# Altium schematic sheet Peripherals.SchDoc
size A3; SheetNumber: 3; SheetTotal: 4; SPICEModelCacheDRPIFCMM: <root> / <DocumentId>DRPIFCMM</DocumentId> / </root>
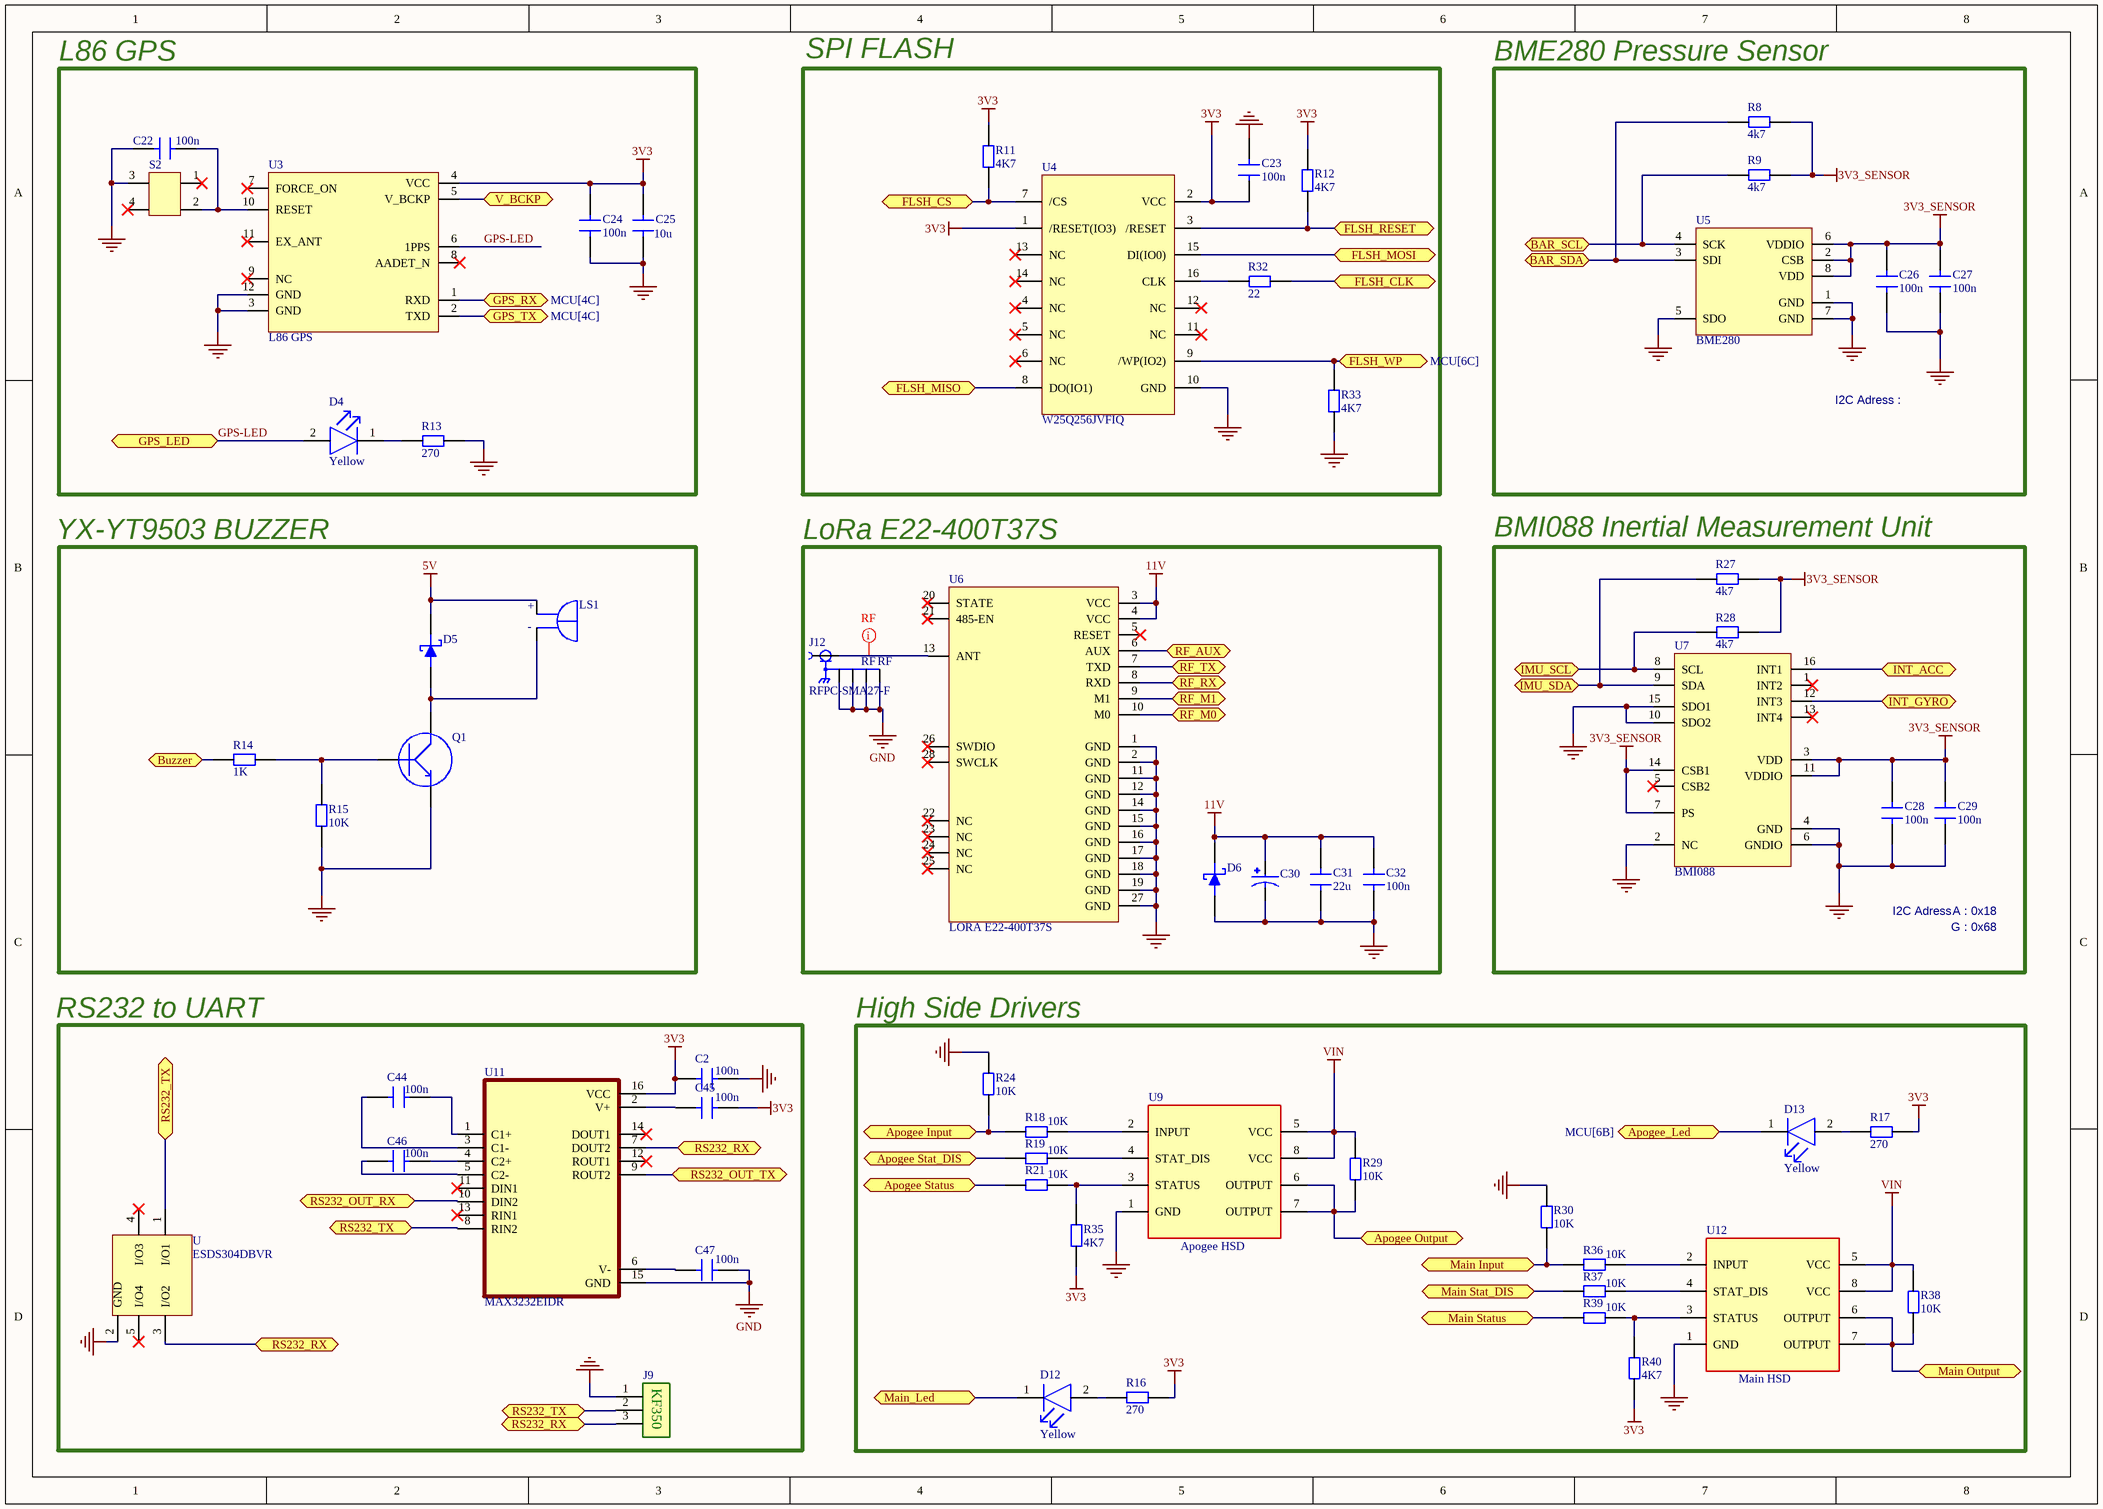
[diagram p0: Peripherals.SchDoc]

## Parts
C2  100n  [CAP 0603]
C22  100n  [CAP 0603]
C23  100n  [CAP 0603]
C24  100n  [CAP 0805]
C25  10u  [CAP 0805]
C26  100n  [CAP 0603]
C27  100n  [CAP 0603]
C28  100n  [CAP 0603]
C29  100n  [CAP 0603]
C30  EEEFK1E101XP  [CAP_EEEFK1E101XP]  (value not drawn)
C31  22u  [CAP 1210]
C32  100n  [CAP 0805]
C44  100n  [CAP 0603]
C45  100n  [CAP 0603]
C46  100n  [CAP 0603]
C47  100n  [CAP 0603]
D4  Yellow  [FP-LTST-C170YKT-MFG]
D5  TMBAT49FILM  [TMBAT49FILM]  (value not drawn)
D6  SMBJ14CA  [SMBJ12CA-13-F]  (value not drawn)
D12  Yellow  [FP-LTST-C170YKT-MFG]
D13  Yellow  [FP-LTST-C170YKT-MFG]
J9  KF350-3P  [KF350-3P]  (value not drawn)
J12  RFPC-SMA27-F  [GRADCONN_RFPC-SMA27-F]
LS1  KXG0912C  [XDCR_KXG0912C]  (value not drawn)
Q1  BC817-25W,115  [BC817-25]  (value not drawn)
R8  4k7  [RES 0603]
R9  4k7  [RES 0603]
R11  4K7  [RES 0805]
R12  4K7  [RES 0805]
R13  270  [RES 0805]
R14  1K  [RES 0805]
R15  10K  [RES 0805]
R16  270  [RES 0805]
R17  270  [RES 0805]
R18  10K  [RES 0603]
R19  10K  [RES 0603]
R21  10K  [RES 0603]
R24  10K  [RES 0603]
R27  4k7  [RES 0603]
R28  4k7  [RES 0603]
R29  10K  [RES 0805]
R30  10K  [RES 0603]
R32  22  [RES 0603]
R33  4K7  [RES 0603]
R35  4K7  [RES 0603]
R36  10K  [RES 0603]
R37  10K  [RES 0603]
R38  10K  [RES 0805]
R39  10K  [RES 0603]
R40  4K7  [RES 0603]
S2  FSM4JSMATR  [FSM4JSMATR]  (value not drawn)
U  ESDS304DBVR  [SOT95P280X145-5N]
U3  L86 GPS  [L86]
U4  W25Q256JVFIQ  [W25Q256JVFIQ]
U5  BME280  [BME280]
U6  LORA E22-400T37S  [LORA E22-400T37S]
U7  BMI088  [BMI088]
U9  VN5E160STR-E  [VN5E160STR-E]  (value not drawn)
U11  MAX3232EIDR  [MAX3232EIDR]
U12  VN5E160STR-E  [VN5E160STR-E]  (value not drawn)

## Blocks framed on the sheet
L86 GPS: C22 C24 C25 D4 R13 S2 U3
SPI FLASH: C23 R11 R12 R32 R33 U4
BME280 Pressure Sensor: C26 C27 R8 R9 U5
YX-YT9503 BUZZER: D5 LS1 Q1 R14 R15
LoRa E22-400T37S: C30-C32 D6 J12 U6
BMI088 Inertial Measurement Unit: C28 C29 R27 R28 U7
RS232 to UART: C2 C44-C47 J9 U U11
High Side Drivers: D12 D13 R16-R19 R21 R24 R29 R30 R35-R40 U9 U12

## Ports
Apogee Input (bidir, see MCU[4C]), Apogee Output (bidir, see Connectors[6D]), Apogee Stat_DIS (bidir, see MCU[4C]), Apogee Status (bidir, see MCU[4C]), Apogee_Led (bidir, see MCU[6B]), BAR_SCL (bidir, see Connectors[7C], MCU[6C]), BAR_SDA (bidir, see Connectors[7C], MCU[6C]), Buzzer (bidir, see MCU[4B]), FLSH_CLK (bidir, see MCU[6C]), FLSH_CS (bidir, see MCU[6B]), FLSH_MISO (bidir, see MCU[6C]), FLSH_MOSI (bidir, see MCU[6C]), FLSH_RESET (bidir, see MCU[4B]), FLSH_WP (bidir, see MCU[6C]), GPS_LED (bidir, see MCU[6C]), GPS_RX (bidir, see MCU[4C]), GPS_TX (bidir, see MCU[4C]), IMU_SCL (bidir, see Connectors[7C], MCU[6B]), IMU_SDA (bidir, see Connectors[7C], MCU[4C]), INT_ACC (bidir, see MCU[6B]), INT_GYRO (bidir, see MCU[4C]), Main Input (bidir, see MCU[6C]), Main Output (bidir, see Connectors[7D]), Main Stat_DIS (bidir, see MCU[6C]), Main Status (bidir, see MCU[6C]), Main_Led (bidir, see MCU[6B]), RF_AUX (bidir, see MCU[6B]), RF_M0 (bidir, see MCU[6B]), RF_M1 (bidir, see MCU[6B]), RF_RX (bidir, see MCU[4C]), RF_TX (bidir, see MCU[4C]), RS232_OUT_RX (bidir, see MCU[6C]), RS232_OUT_TX (bidir, see MCU[4C]), RS232_RX (bidir, see Peripherals[1D], Peripherals[2D]), RS232_RX (bidir, see Peripherals[1D], Peripherals[3D]), RS232_RX (bidir, see Peripherals[2D], Peripherals[3D]), RS232_TX (bidir, see Peripherals[1D], Peripherals[2D]), RS232_TX (bidir, see Peripherals[2D]), V_BCKP (bidir, see MCU[6B], Power[3C])

## Nets
3V3: C2.1 C23.1 C24.2 C25.2 C45.2 R11.2 R12.2 R16.2 R17.2 R35.1 R40.1 U3.4(VCC) U4.1(/RESET(IO3)) U4.2(VCC) U11.16(VCC)
3V3_SENSOR: C26.2 C27.2 C28.2 C29.2 R8.2 R9.2 R27.2 R28.2 U5.2(CSB) U5.6(VDDIO) U5.8(VDD) U7.3(VDD) U7.7(PS) U7.11(VDDIO) U7.14(CSB1)
5V: D5.1 LS1.P(POS)
11V: C30.1 C31.2 C32.2 D6.2 U6.3(VCC) U6.4(VCC)
GND: C2.2 C22.1 C23.2 C24.1 C25.1 C26.1 C27.1 C28.1 C29.1 C30.2 C31.1 C32.1 C47.2 D6.1 J9.1 J12.G1 J12.G2 J12.G3 J12.G4 Q1.2(E) R13.2 R15.1 R24.2 R30.2 R33.1 S2.3 U.2(GND) U3.3(GND) U3.12(GND) U4.10(GND) U5.1(GND) U5.5(SDO) U5.7(GND) U6.1(GND) U6.2(GND) U6.11(GND) U6.12(GND) U6.14(GND) U6.15(GND) U6.16(GND) U6.17(GND) U6.18(GND) U6.19(GND) U6.27(GND) U7.2(NC) U7.4(GND) U7.6(GNDIO) U7.10(SDO2) U7.15(SDO1) U9.1(GND) U11.15(GND) U12.1(GND)
VIN: R29.2 R38.2 U9.5(VCC) U9.8(VCC) U12.5(VCC) U12.8(VCC)
Apogee Input: R18.1 R24.1 ; port Apogee Input
Apogee Output: R29.1 U9.6(OUTPUT) U9.7(OUTPUT) ; port Apogee Output
Apogee Stat_DIS: R19.1 ; port Apogee Stat_DIS
Apogee Status: R21.1 ; port Apogee Status
Apogee_Led: D13.1(C) ; port Apogee_Led
BAR_SCL: R9.1 U5.4(SCK) ; port BAR_SCL
BAR_SDA: R8.1 U5.3(SDI) ; port BAR_SDA
Buzzer: R14.1 ; port Buzzer
FLSH_CLK: R32.2 ; port FLSH_CLK
FLSH_CS: R11.1 U4.7(/CS) ; port FLSH_CS
FLSH_MISO: U4.8(DO(IO1)) ; port FLSH_MISO
FLSH_MOSI: U4.15(DI(IO0)) ; port FLSH_MOSI
FLSH_RESET: R12.1 U4.3(/RESET) ; port FLSH_RESET
FLSH_WP: R33.2 U4.9(/WP(IO2)) ; port FLSH_WP
GPS-LED: D4.2(A) U3.6(1PPS) ; port GPS_LED
GPS_RX: U3.1(RXD) ; port GPS_RX
GPS_TX: U3.2(TXD) ; port GPS_TX
IMU_SCL: R28.1 U7.8(SCL) ; port IMU_SCL
IMU_SDA: R27.1 U7.9(SDA) ; port IMU_SDA
INT_ACC: U7.16(INT1) ; port INT_ACC
INT_GYRO: U7.12(INT3) ; port INT_GYRO
Main Input: R30.1 R36.1 ; port Main Input
Main Output: R38.1 U12.6(OUTPUT) U12.7(OUTPUT) ; port Main Output
Main Stat_DIS: R37.1 ; port Main Stat_DIS
Main Status: R39.1 ; port Main Status
Main_Led: D12.1(C) ; port Main_Led
RF_AUX: U6.6(AUX) ; port RF_AUX
RF_M0: U6.10(M0) ; port RF_M0
RF_M1: U6.9(M1) ; port RF_M1
RF_RX: U6.8(RXD) ; port RF_RX
RF_TX: U6.7(TXD) ; port RF_TX
RS232_OUT_RX: U11.10(DIN2) ; port RS232_OUT_RX
RS232_OUT_TX: U11.9(ROUT2) ; port RS232_OUT_TX
RS232_RX: J9.3 U.3(I/O2) U11.7(DOUT2) ; port RS232_RX
RS232_TX: J9.2 U.1(I/O1) U11.8(RIN2) ; port RS232_TX
V_BCKP: U3.5(V_BCKP) ; port V_BCKP
NetC22_2: C22.2 S2.2 U3.10(RESET)
NetC44_1: C44.1 U11.3(C1-)
NetC44_2: C44.2 U11.1(C1+)
NetC45_1: C45.1 U11.2(V+)
NetC46_1: C46.1 U11.5(C2-)
NetC46_2: C46.2 U11.4(C2+)
NetC47_1: C47.1 U11.6(V-)
NetD4_1: D4.1(C) R13.1
NetD5_2: D5.2 LS1.N(NEG) Q1.3(C)
NetD12_2: D12.2(A) R16.1
NetD13_2: D13.2(A) R17.1
NetJ12_1: J12.1 U6.13(ANT)
NetQ1_1: Q1.1(B) R14.2 R15.2
NetR18_2: R18.2 U9.2(INPUT)
NetR19_2: R19.2 U9.4(STAT_DIS)
NetR21_2: R21.2 R35.2 U9.3(STATUS)
NetR32_1: R32.1 U4.16(CLK)
NetR36_2: R36.2 U12.2(INPUT)
NetR37_2: R37.2 U12.4(STAT_DIS)
NetR39_2: R39.2 R40.2 U12.3(STATUS)

Not connected (* = marked no-connect by the designer): S2 1* 4*; U 4(I/O3)* 5(I/O4)*; U3 7(FORCE_ON)* 8(AADET_N)* 9(NC)* 11(EX_ANT)*; U4 4(NC)* 5(NC)* 6(NC)* 11(NC)* 12(NC)* 13(NC)* 14(NC)*; U6 5(RESET)* 20(STATE)* 21(485-EN)* 22(NC)* 23(NC)* 24(NC)* 25(NC)* 26(SWDIO)* 28(SWCLK)*; U7 1(INT2)* 5(CSB2)* 13(INT4)*; U11 11(DIN1)* 12(ROUT1)* 13(RIN1)* 14(DOUT1)*

## Layout directives
net class RF; Parameter 1: RF: NetJ12_1

## Notes on the sheet
- I2C Adress :
- I2C Adress
- A : 0x18
- G : 0x68
- (near U9) Apogee HSD
- (near U12) Main HSD
- (in symbol KF350-3P) KF350
- (in symbol KXG0912C) +; -

## Library data of the parts
C2 C44-C47 = CAP 0603 25V: Capacitor SMD 0603 25V
C22 C23 C26-C29 = CAP 0603 50V: Capacitor SMD 0603 50V
C24 C32 = CAP 0805 50V: Capacitor SMD 0805 50V
C25 = CAP 0805 25V: Capacitor SMD 0805 25V
C30 = 100uF AL CAP: Capacitor;Aluminum Electrolytic;Ecap 100uF 25V D8 Case FK SMT | Panasonic Electronic Components EEEFK1E101XP; SnapEDA_Link: https://www.snapeda.com/parts/EEEFK1E101XP/Panasonic/view-part/?ref=snap; Package: RADIAL-2 Panasonic; Value: *; MF: Panasonic; MP: EEEFK1E101XP; Check_prices: https://www.snapeda.com/parts/EEEFK1E101XP/Panasonic/view-part/?ref=eda
C31 = CAP 1210 25V: Capacitor SMD 1210 25V
D4 D12 D13 = CMP-1674-00003-7: LED YELLOW CLEAR SMD; Viewing Angle: 130°; Luminous Intensity: 6mcd; Test Current: 10mA; Number of Elements: 1; Forward Current: 20mA; Forward Voltage: 2.1V; Reverse Voltage: 5V; Power Dissipation: 60mW; Lens Style: Diffused; Wavelength: 585nm; Lens Color: Colorless; Dominant Wavelength: 588nm; RoHS Compliant: Yes; Height: 1.1mm; Min Operating Temperature: -55°C; Max Operating Temperature: 85°C; Number of LEDs: 1; Mount: Surface Mount; Radiation Hardening: No; Illumination Color: Yellow; Length: 3.2mm; Series: CHIPLED 0805; Package Quantity: 1; Packaging: Tape and Reel; Color: Yellow; Depth: 1.6mm; Case/Package: 0805; Lens Transparency: Clear; Case Code (Imperial): 0805; Width: 1.25mm; Case Code (Metric): 2012; Lead Free: Lead Free; Power Rating: 60mW; Number of Pins: 2
D5 = TMBAT49FILM: Rectifier Diode Small Signal Schottky Si 80V 0.5A 2-Pin MELF T/R; Manufacturer: STMicroelectronics; Supplier 1: Mouser; Manufacturer Part Number: TMBAT49FILM; RoHS: Yes; Category: Rectifier Diodes; Stock 1: 11456; Pricing 1: 1=0,55, 10=0,468, 50=0,468, 100=0,326, 1000=0,228, 10000=0,159 (USD); ComponentLink1URL: https://datasheet.ciiva.com/4715/cd00000809-92451-4715102.pdf?src-supplier=Mouser; ComponentLink1Description: https://datasheet.ciiva.com/4715/cd00000809-92451-4715102.pdf?src-supplier=Mouser; ComponentLink2URL: https://datasheet.ciiva.com/16988/0900766b80db299a-16988744.pdf?src-supplier=Allied+Electronics; ComponentLink2Description: https://datasheet.ciiva.com/16988/0900766b80db299a-16988744.pdf?src-supplier=Allied+Electronics; ComponentLink3URL: https://datasheet.ciiva.com/22697/1766334-22697011.pdf?src-supplier=Element14; ComponentLink3Description: https://datasheet.ciiva.com/22697/1766334-22697011.pdf?src-supplier=Element14; ComponentLink4URL: https://datasheet.ciiva.com/16501/cd00000809-16501349.pdf?src-supplier=Future+Electronics; ComponentLink4Description: https://datasheet.ciiva.com/16501/cd00000809-16501349.pdf?src-supplier=Future+Electronics; ComponentLink5URL: https://datasheet.ciiva.com/15144/getdatasheetpartid-39750-15144086.pdf?src-supplier=Verical; ComponentLink5Description: https://datasheet.ciiva.com/15144/getdatasheetpartid-39750-15144086.pdf?src-supplier=Verical; ComponentLink6URL: https://datasheet.ciiva.com/915/cd00000809-915819.pdf?src-supplier=Digikey; ComponentLink6Description: https://datasheet.ciiva.com/915/cd00000809-915819.pdf?src-supplier=Digikey; ComponentLink7URL: https://datasheet.ciiva.com/915/cd00000809-915820.pdf?src-supplier=Digikey; ComponentLink7Description: https://datasheet.ciiva.com/915/cd00000809-915820.pdf?src-supplier=Digikey; ComponentLink8URL: https://datasheet.ciiva.com/915/cd00000809-915821.pdf?src-supplier=Digikey; ComponentLink8Description: https://datasheet.ciiva.com/915/cd00000809-915821.pdf?src-supplier=Digikey; ComponentLink9URL: https://datasheet.ciiva.com/7622/1766334-7622348.pdf?src-supplier=Element14; ComponentLink9Description: https://datasheet.ciiva.com/7622/1766334-7622348.pdf?src-supplier=Element14; ComponentLink10URL: https://datasheet.ciiva.com/7964/cd00000809-7964118.pdf?src-supplier=Element14; ComponentLink10Description: https://datasheet.ciiva.com/7964/cd00000809-7964118.pdf?src-supplier=Element14
D6 = SMBJ14CA: TVS DIODE 14VWM 23.2VC DO214AA; Manufacturer: Littelfuse; Operating Supply Voltage: 14V; Max Surge Current: 25.9A; Number of Channels: 1; Polarity: Bidirectional; Breakdown Voltage: 15.6V; Clamping Voltage: 23.2V; Peak Pulse Power: 600W; Power Line Protection: No; Test Current: 1mA; Leakage Current: 1uA; Diode Type: ZENER; Max Breakdown Voltage: 17.2V; Supplier 1: Future Electronics; Manufacturer Part Number: SMBJ14CA; RoHS: Yes; Category: TVS Diodes; Stock 1: 1300; Pricing 1: 1=0,36, 15=0,29, 75=0,245, 300=0,205, 1500=0,163 (USD); Mount: Surface Mount; Case/Package: DO-214AA; Number of Pins: 2; Weight: 0.00328oz; Min Operating Temperature: -65°C; Max Operating Temperature: 150°C; Packaging: Tape and Reel; Package Quantity: 3000; Reverse Breakdown Voltage: 15.6V; Number of Bidirectional Channels: 1; Reverse Standoff Voltage: 14V; Min Breakdown Voltage: 15.6V; Number of Elements: 1; Peak Pulse Current: 25.9A; Voltage Rating (DC): 14V; Series: SMBJ; Direction: Bidirectional; Termination: SMD/SMT; Max Power Dissipation: 600W; Power Dissipation: 600W; Current: 1mA; Voltage: 14V; Clamping Voltage-Max: 23.2V; Length: 5.59mm; Width: 3.94mm; Height: 2.44mm; RoHS Compliant: Yes; Lead Free: Lead Free; Reach SVHC Compliant: No; ComponentLink1URL: https://datasheet.ciiva.com/331/littelfuse-tvs-diode-smbj-datasheet-pdf-331530.pdf?src-supplier=Digikey; ComponentLink1Description: https://datasheet.ciiva.com/331/littelfuse-tvs-diode-smbj-datasheet-pdf-331530.pdf?src-supplier=Digikey; ComponentLink2URL: https://datasheet.ciiva.com/331/littelfuse-tvs-diode-smbj-datasheet-pdf-331531.pdf?src-supplier=Digikey; ComponentLink2Description: https://datasheet.ciiva.com/331/littelfuse-tvs-diode-smbj-datasheet-pdf-331531.pdf?src-supplier=Digikey; ComponentLink3URL: https://datasheet.ciiva.com/331/littelfuse-tvs-diode-smbj-datasheet-pdf-331529.pdf?src-supplier=Digikey; ComponentLink3Description: https://datasheet.ciiva.com/331/littelfuse-tvs-diode-smbj-datasheet-pdf-331529.pdf?src-supplier=Digikey
J12 = RFPC-SMA27-F: MF: {'manufacturer': u'GradConn'}; Package: None; Price: None; Value: *; MP: RFPC-SMA27-F; Availability: Unavailable
LS1 = KXG0912C: Magnetic Indicator(Active Buzzer), 85Hz, 2.73 dB (SPL), 9.6 diameter(Ø)/L, Width, 5 Height, Pine Type; MP: KXG0912C; Package: None; Price: None; Availability: Unavailable; Value: *
Q1 = BC817-25W,115: BC817 Series 45 V 500 mA NPN General Purpose Transistor - SOT-23; Manufacturer: Nexperia; Supplier 1: Future Electronics; Manufacturer Part Number: BC817-25W,115; RoHS: Yes; Category: BJTs; Stock 1: 99000; Pricing 1: 3000=0,0169, 12000=0,0162, 45000=0,0155, 90000=0,0152, 225000=0,0144 (USD); ComponentLink1URL: https://datasheet.octopart.com/BC817-25W%2C115-NXP-datasheet-29749.pdf?src-supplier=Future+Electronics; ComponentLink1Description: https://datasheet.octopart.com/BC817-25W%2C115-NXP-datasheet-29749.pdf?src-supplier=Future+Electronics; ComponentLink2URL: http://www.farnell.com/datasheets/699988.pdf?src-supplier=Newark; ComponentLink2Description: http://www.farnell.com/datasheets/699988.pdf?src-supplier=Newark; ComponentLink3URL: https://datasheet.octopart.com/BC817-25W%2C115-Nexperia-datasheet-155782301.pdf?src-supplier=TME; ComponentLink3Description: https://datasheet.octopart.com/BC817-25W%2C115-Nexperia-datasheet-155782301.pdf?src-supplier=TME; Supplier Part Number 1: 5067352
R8 R9 R18 R19 R21 R24 R27 R28 R30 R32 R33 R35-R37 R39 R40 = RES 0603: Resistor SMD 0603
R11-R17 R29 R38 = RES 0805: Resistor SMD 0805
S2 = FSM4JSMATR: Switch Tactile OFF (ON) SPST Round Button Gull Wing 0.05A 24VDC 1.57N SMD T/R; Manufacturer: TE Connectivity Alcoswitch; Supplier 1: Digi-Key; Manufacturer Part Number: FSM4JSMATR; RoHS: Yes; Category: Pushbutton Switches; Stock 1: 84996; Pricing 1: 1=0,36, 10=0,351, 25=0,33, 100=0,2866, 250=0,26, 500=0,24188 (USD); ComponentLink1URL: https://datasheet.ciiva.com/16320/eng-cs-1308111-1-switches-core-program-catalog-0308-16320065.pdf?src-supplier=Future+Electronics; ComponentLink1Description: https://datasheet.ciiva.com/16320/eng-cs-1308111-1-switches-core-program-catalog-0308-16320065.pdf?src-supplier=Future+Electronics; ComponentLink2URL: https://datasheet.ciiva.com/1530/1683375-1530944.pdf?src-supplier=Element14; ComponentLink2Description: https://datasheet.ciiva.com/1530/1683375-1530944.pdf?src-supplier=Element14; ComponentLink3URL: https://datasheet.ciiva.com/23765/1486934-23765878.pdf?src-supplier=Newark; ComponentLink3Description: https://datasheet.ciiva.com/23765/1486934-23765878.pdf?src-supplier=Newark; ComponentLink4URL: https://datasheet.ciiva.com/7638/921681-7638037.pdf?src-supplier=Element14; ComponentLink4Description: https://datasheet.ciiva.com/7638/921681-7638037.pdf?src-supplier=Element14
U = ESDS304DBVR: 2-channel, 3.6-V data-line surge and 30k-V ESD protection diode array 5-SOT-23 -40 to 125; MF: Texas Instruments; Texas_Instruments-Purchase-URL: https://snapeda.com/shop?store=Texas+Instruments&id=3215782; Price: None; SnapEDA_Link: https://www.snapeda.com/parts/ESDS304DBVR/Texas%20Instruments/view-part/3215782/?ref=snap; MP: ESDS304DBVR; Value: *; Availability: Unavailable; Package: SOT-23-5 Texas Instruments
U4 = W25Q256JVFIQ: IC FLASH 256MBIT SPI/QUAD 16SOIC .....                                      The W25Q256JV (256M-bit) Serial Flash memory provides a storage solution for systems with limited / space, pins and power. The 25Q series offers flexibility and performance well beyond ordinary Serial Flash / devices. They are ideal for code shadowing to RAM, executing code directly from Dual/Quad SPI (XIP) / and storing voice, text and data. The device operates on a single 2.7V to 3.6V power supply with current / consumption as low as 1µA for power-down
U5 = BME280: SENSOR PRESSURE HUMIDITY TEMP; Manufacturer: Bosch; Sensor Type: Temperature; Output Type: SPI,I2C; Accuracy: 3%; Response Time: 1s; Supplier 1: Future Electronics; Manufacturer Part Number: BME280; RoHS: No; Category: Temperature and Humidity Sensors; Stock 1: 5185; Pricing 1: 1=6,1, 20=5,53, 150=5,14, 1000=4,78, 5000=4,48 (USD); Mount: Surface Mount; Case/Package: LGA; Number of Pins: 8; Min Operating Temperature: -40°C; Max Operating Temperature: 85°C; Packaging: Cut Tape; Lead Free: Lead Free; ComponentLink1URL: https://ae-bst.resource.bosch.com/media/_tech/media/datasheets/BST-BME280-DS002.pdf?src-supplier=Digi-Key; ComponentLink1Description: https://ae-bst.resource.bosch.com/media/_tech/media/datasheets/BST-BME280-DS002.pdf?src-supplier=Digi-Key; ComponentLink2URL: https://ae-bst.resource.bosch.com/media/_tech/media/product_flyer/BME280_Productflyer_BST_20170109.pdf?src-supplier=Mouser; ComponentLink2Description: https://ae-bst.resource.bosch.com/media/_tech/media/product_flyer/BME280_Productflyer_BST_20170109.pdf?src-supplier=Mouser; ComponentLink3URL: https://ae-bst.resource.bosch.com/media/_tech/media/product_flyer/BME280_Productflyer_BST_20170109.pdf?src-supplier=Arrow+Electronics; ComponentLink3Description: https://ae-bst.resource.bosch.com/media/_tech/media/product_flyer/BME280_Productflyer_BST_20170109.pdf?src-supplier=Arrow+Electronics; ComponentLink4URL: https://ae-bst.resource.bosch.com/media/_tech/media/product_flyer/BME280_Productflyer_BST_20170109.pdf?src-supplier=NAC+Semi; ComponentLink4Description: https://ae-bst.resource.bosch.com/media/_tech/media/product_flyer/BME280_Productflyer_BST_20170109.pdf?src-supplier=NAC+Semi
U6 = LORA E22-400T37S: E22-400T37S LoRa Module
U7 = BMI088: BMI088 Series 3.6 V 6 Axis Digital Output Accelerometer Motion Sensor - LGA-16; Manufacturer: Bosch Tools; Supplier 1: Arrow Electronics; Manufacturer Part Number: BMI088; RoHS: No; Category: Inertial Measurement Units (IMUs); Stock 1: 2228; Pricing 1: 1=3,4884, 10=3,3155, 25=3,2816, 50=3,2477, 100=3,2147, 500=3,1828 (USD); ComponentLink1URL: https://ae-bst.resource.bosch.com/media/_tech/media/product_flyer/Bosch_Sensortec_Product_flyer_BMI088.pdf?src-supplier=Digi-Key; ComponentLink1Description: https://ae-bst.resource.bosch.com/media/_tech/media/product_flyer/Bosch_Sensortec_Product_flyer_BMI088.pdf?src-supplier=Digi-Key; ComponentLink2URL: https://ae-bst.resource.bosch.com/media/_tech/media/application_notes/BST-MIS-HS001.pdf?src-supplier=Digi-Key; ComponentLink2Description: https://ae-bst.resource.bosch.com/media/_tech/media/application_notes/BST-MIS-HS001.pdf?src-supplier=Digi-Key
U9 U12 = VN5E160STR-E: Power Switch/Driver 1:1 N-Channel 7A 8-SOIC / High Side Driver; MF: STMicroelectronics; SnapEDA_Link: https://www.snapeda.com/parts/VN5E160STR-E/STMicroelectronics/view-part/?ref=snap; Package: SO-8 STMicroelectronics; Value: *; MP: VN5E160STR-E; Check_prices: https://www.snapeda.com/parts/VN5E160STR-E/STMicroelectronics/view-part/?ref=eda
U11 = MAX3232EIDR: 3- to 5.5-V dual channel 250kbps RS-232 line driver/receiver with +/-15-kV IEC-ESD protection; MF: Texas Instruments; SnapEDA_Link: https://www.snapeda.com/parts/MAX3232EIDR/Texas+Instruments/view-part/?ref=snap; Package: SOIC-16 Texas Instruments; Value: *; MP: MAX3232EIDR; Check_prices: https://www.snapeda.com/parts/MAX3232EIDR/Texas+Instruments/view-part/?ref=eda